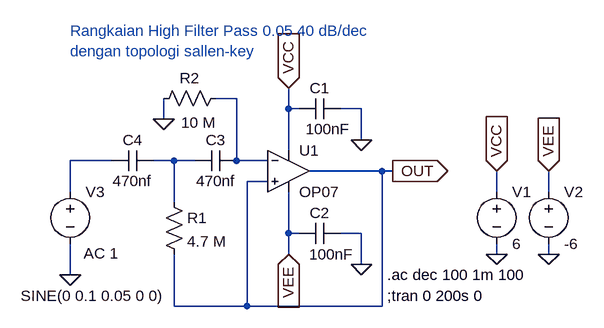
[diagram p0: schematic High Pass Filter.asc]
High Pass Filter.asc, the LTspice schematic file:
Version 4
SHEET 1 880 712
WIRE 160 64 128 64
WIRE 240 80 240 48
WIRE 256 80 240 80
WIRE 352 80 320 80
WIRE 48 96 48 64
WIRE 352 128 352 80
WIRE 240 144 240 80
WIRE -32 160 -96 160
WIRE 64 160 32 160
WIRE 96 160 64 160
WIRE 160 160 160 64
WIRE 208 160 160 160
WIRE 384 176 272 176
WIRE 400 176 384 176
WIRE 208 192 176 192
WIRE -96 208 -96 160
WIRE 560 208 560 176
WIRE 640 208 640 176
WIRE 64 224 64 160
WIRE 240 272 240 208
WIRE 256 272 240 272
WIRE 352 272 320 272
WIRE 240 304 240 272
WIRE 560 304 560 288
WIRE 640 304 640 288
WIRE 352 320 352 272
WIRE -96 336 -96 288
WIRE 64 384 64 304
WIRE 176 384 176 192
WIRE 176 384 64 384
WIRE 384 384 384 176
WIRE 384 384 176 384
FLAG 240 48 VCC
IOPIN 240 48 In
FLAG 560 176 VCC
IOPIN 560 176 In
FLAG 352 128 0
FLAG 560 304 0
FLAG 240 304 VEE
IOPIN 240 304 In
FLAG 352 320 0
FLAG 640 304 0
FLAG 640 176 VEE
IOPIN 640 176 In
FLAG 400 176 OUT
IOPIN 400 176 Out
FLAG -96 336 0
FLAG 48 96 0
SYMBOL OpAmps\\OP07 240 112 R0
SYMATTR InstName U1
SYMBOL voltage 560 192 R0
WINDOW 123 0 0 Left 0
WINDOW 39 0 0 Left 0
SYMATTR InstName V1
SYMATTR Value 6
SYMBOL voltage 640 192 R0
WINDOW 123 0 0 Left 0
WINDOW 39 0 0 Left 0
SYMATTR InstName V2
SYMATTR Value -6
SYMBOL cap 320 64 R90
WINDOW 0 0 32 VBottom 2
WINDOW 3 32 19 VTop 2
SYMATTR InstName C1
SYMATTR Value 100nF
SYMBOL cap 320 256 R90
WINDOW 0 0 32 VBottom 2
WINDOW 3 33 14 VTop 2
SYMATTR InstName C2
SYMATTR Value 100nF
SYMBOL cap 160 144 R90
WINDOW 0 0 32 VBottom 2
WINDOW 3 32 32 VTop 2
SYMATTR InstName C3
SYMATTR Value 470nf
SYMBOL cap 32 144 R90
WINDOW 0 0 32 VBottom 2
WINDOW 3 32 32 VTop 2
SYMATTR InstName C4
SYMATTR Value 470nf
SYMBOL res 48 208 R0
SYMATTR InstName R1
SYMATTR Value 4.7 M
SYMBOL voltage -96 192 R0
WINDOW 123 21 111 Left 2
WINDOW 39 0 0 Left 0
WINDOW 3 -76 176 Left 2
SYMATTR Value2 AC 1
SYMATTR Value SINE(0 0.1 0.05 0 0)
SYMATTR InstName V3
SYMBOL res 144 48 R90
WINDOW 0 0 56 VBottom 2
WINDOW 3 38 42 VTop 2
SYMATTR InstName R2
SYMATTR Value 10 M
TEXT -96 -40 Left 2 ;Rangkaian High Filter Pass 0.05 40 dB/dec\ndengan topologi sallen-key
TEXT 392 368 Left 2 !;tran 0 200s 0
TEXT 392 336 Left 2 !.ac dec 100 1m 100

The netlist it stands for:
* High Pass Filter.asc
XU1 OUT N001 VCC VEE OUT LT1001  ; OP07, pins In+ In- V+ V- OUT
V1 VCC 0 6
V2 VEE 0 -6
C1 0 VCC 100nF
C2 0 VEE 100nF
C3 N001 N003 470nf
C4 N003 N002 470nf
R1 N003 OUT 4.7 M
V3 N002 0 SINE(0 0.1 0.05 0 0) AC 1
R2 N001 0 10 M
* Rangkaian High Filter Pass 0.05 40 dB/dec
* dengan topologi sallen-key
;tran 0 200s 0
.ac dec 100 1m 100
.lib LTC.lib
.backanno
.end